# EAGLE schematic BitsTunnel (EAGLE 9.4.2)
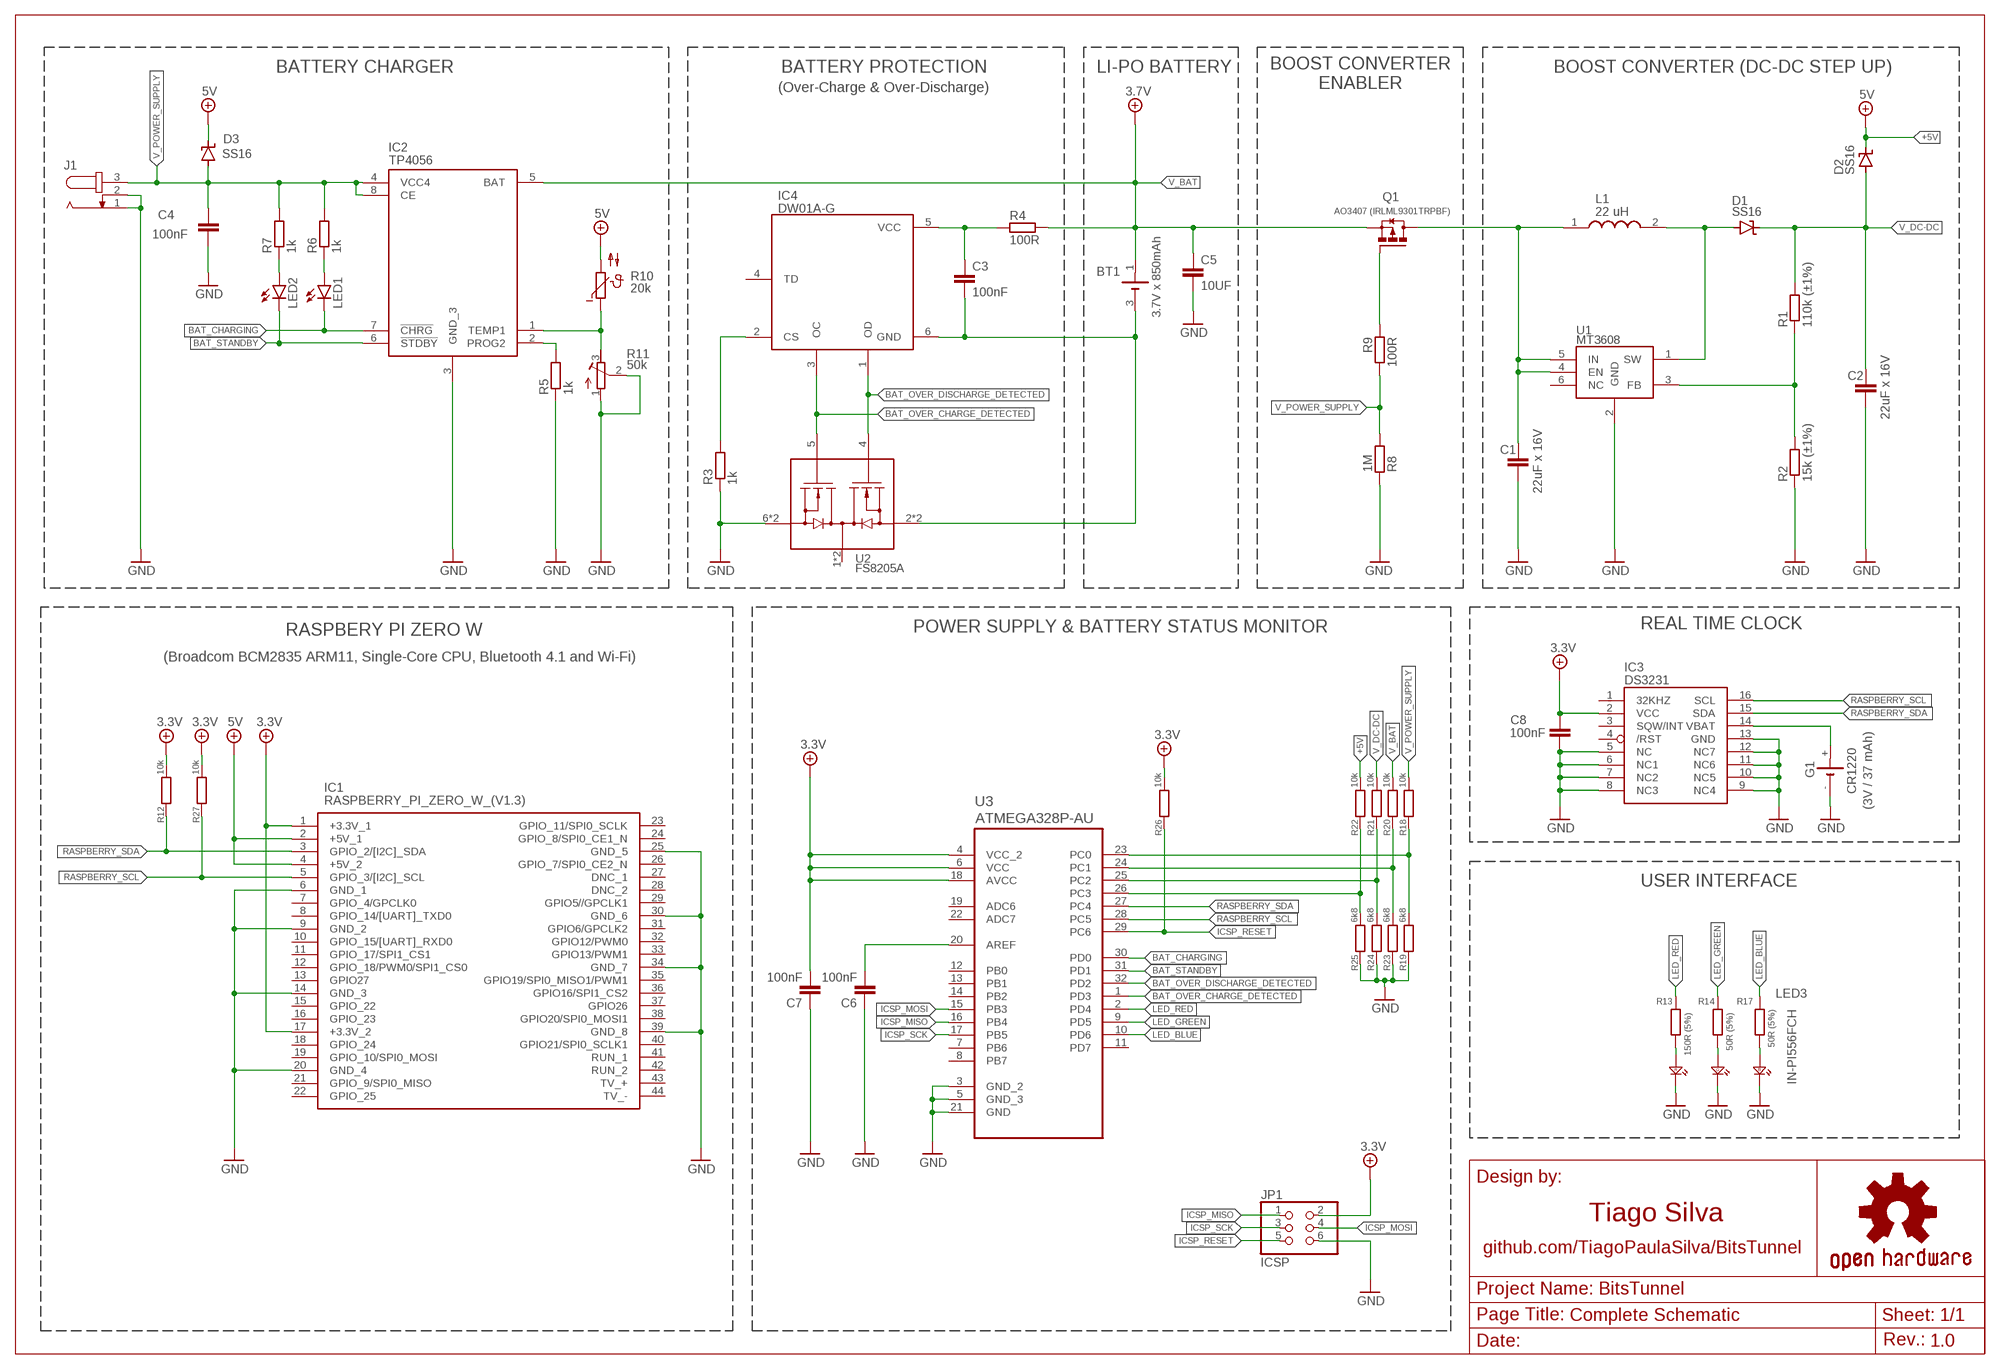
[diagram p0: schematic, sheet 1]

## Parts
BT1  3.7V x 850mAh  BATTERY-3PIN  [JST-3PIN]
C1  22uF x 16V  C-EUC0805  [C0805]
C2  22uF x 16V  C-EUC0805  [C0805]
C3  100nF  C-EUC0603  [C0603]
C4  100nF  C-EUC0603  [C0603]
C5  10UF  C-EUC0603  [C0603]
C6  100nF  C-EUC0805  [C0805]
C7  100nF  C-EUC0805  [C0805]
C8  100nF  C-EUC0805  [C0805]
D1  SS16  SUPPRESSOR-SMBJ  [SMBJ]
D2  SS16  SUPPRESSOR-SMBJ  [SMBJ]
D3  SS16  SUPPRESSOR-SMBJ  [SMBJ]
G1  CR1220  CH291-1220LF  [CH291-1220LF]
IC1  RASPBERRY_PI_ZERO_W_(V1.3)  [RASPBERRYPIZEROWV13]
IC2  TP4056  [SOIC127P600X175-9N]
IC3  DS3231/SO  [SO16W]
IC4  DW01A-G  [SOT95P190X145-6N]
J1  JACK-PLUG0  [SPC4077]
JP1  ICSP  PINHD-2X3  [2X03]
L1  22 uH  INDUCTOR  [INDUCTOR]
LED1  LEDCHIPLED_0805  [CHIPLED_0805]
LED2  LEDCHIPLED_0805  [CHIPLED_0805]
LED3  IN-PI556FCH  [INPI556FCH]
Q1  AO3407 (IRLML9301TRPBF)  IRLML6402TRPBF  [SOT23]
R1  110k (±1%)  R-EU_R0603  [R0603]
R2  15k (±1%)  R-EU_R0603  [R0603]
R3  1k  R-EU_R0603  [R0603]
R4  100R  R-EU_R0603  [R0603]
R5  1k  R-EU_R0603  [R0603]
R6  1k  R-EU_R0603  [R0603]
R7  1k  R-EU_R0603  [R0603]
R8  1M  R-EU_R0603  [R0603]
R9  100R  R-EU_R0603  [R0603]
R10  20k  NTC640  [P640]
R11  50k  R-TRIMM64P  [RTRIM64P]
R12  10k  R-EU_M0805  [M0805]
R13  150R (5%)  R-EU_R0603  [R0603]
R14  50R (5%)  R-EU_R0603  [R0603]
R17  50R (5%)  R-EU_R0603  [R0603]
R18  10k  R-EU_M0805  [M0805]
R19  6k8  R-EU_M0805  [M0805]
R20  10k  R-EU_M0805  [M0805]
R21  10k  R-EU_M0805  [M0805]
R22  10k  R-EU_M0805  [M0805]
R23  6k8  R-EU_M0805  [M0805]
R24  6k8  R-EU_M0805  [M0805]
R25  6k8  R-EU_M0805  [M0805]
R26  10k  R-EU_M0805  [M0805]
R27  10k  R-EU_M0805  [M0805]
U1  MT3608  [SOT95P280X145-6N]
U2  FS8205A  [SOP65P640X120-8N]
U3  ATMEGA328P-AU  [QFP80P900X900X120-32N]

## Nets
3.3V: C7.2 C8.2 IC1.1(+3.3V_1) IC1.17(+3.3V_2) IC3.2(VCC) JP1.2 R12.1 R26.1 R27.1 U3.4(VCC_2) U3.6(VCC) U3.18(AVCC)
+5V: D2.C D3.C IC1.2(+5V_1) IC1.4(+5V_2) R10.2 R22.1 ; supply symbol labelled 5V
BAT_CHARGING: IC2.7(!CHRG) LED1.C U3.30(PD0)
BAT_OVER_CHARGE_DETECTED: IC4.3(OC) U2.5(G2) U3.1(PD3)
BAT_OVER_DISCHARGE_DETECTED: IC4.1(OD) U2.4(G1) U3.32(PD2)
BAT_STANDBY: IC2.6(!STDBY) LED2.C U3.31(PD1)
GND [gnd]: C1.2 C2.2 C4.2 C5.2 C6.1 C7.1 C8.1 G1.- IC1.6(GND_1) IC1.9(GND_2) IC1.14(GND_3) IC1.20(GND_4) IC1.25(GND_5) IC1.30(GND_6) IC1.34(GND_7) IC1.39(GND_8) IC2.3(GND_3) IC3.5(NC) IC3.6(NC1) IC3.7(NC2) IC3.8(NC3) IC3.9(NC4) IC3.10(NC5) IC3.11(NC6) IC3.12(NC7) IC3.13(GND) J1.1 J1.2 JP1.6 LED3.4(KB4) LED3.5(KG6) LED3.6(KR5) R2.1 R3.1 R5.1 R8.2 R11.1(A) R11.2(S) R19.2 R23.2 R24.2 R25.2 U1.2(GND) U2.6(S2_1) U2.7(S2_1) U3.3(GND_2) U3.5(GND_3) U3.21(GND)
ICSP_MISO: JP1.1 U3.16(PB4)
ICSP_MOSI: JP1.4 U3.15(PB3)
ICSP_RESET: JP1.5 R26.2 U3.29(PC6)
ICSP_SCK: JP1.3 U3.17(PB5)
LED_BLUE: R17.1 U3.10(PD6)
LED_GREEN: R14.1 U3.9(PD5)
LED_RED: R13.1 U3.2(PD4)
N$1: R1.1 R2.2 U1.3(FB)
N$2: LED3.2(AR2) R13.2
N$3: D1.A L1.2 U1.1(SW)
N$6: IC2.2(PROG2) R5.2
N$7: IC4.2(CS) R3.2
N$8: C3.1 IC4.5(VCC) R4.2
N$9: G1.+ IC3.14(VBAT)
N$10: BT1.3(-) C3.2 IC4.6(GND) U2.2(S1_1) U2.3(S1_1)
N$11: LED1.A R6.1
N$13: C1.1 L1.1 Q1.3(D) U1.4(EN) U1.5(IN)
N$14: LED2.A R7.1
N$15: Q1.1(G) R9.2
N$16 [gnd]: IC2.1(TEMP1) R10.1 R11.3(E)
N$17: C6.2 U3.20(AREF)
N$18: R22.2 R25.1 U3.26(PC3)
N$19: R21.2 R24.1 U3.25(PC2)
N$20: R20.2 R23.1 U3.24(PC1)
N$21: LED3.1(AG1) R14.2
N$22: R18.2 R19.1 U3.23(PC0)
N$26: LED3.3(AB3) R17.2
RASPBERRY_SCL: IC1.5(GPIO_3/[I2C]_SCL) IC3.16(SCL) R27.2 U3.28(PC5)
RASPBERRY_SDA: IC1.3(GPIO_2/[I2C]_SDA) IC3.15(SDA) R12.2 U3.27(PC4)
V_BAT: BT1.1(+) C5.1 IC2.5(BAT) Q1.2(S) R4.1 R20.1 ; supply symbol labelled 3.7V
V_DC-DC: C2.1 D1.C D2.A R1.2 R21.1
V_POWER_SUPPLY: C4.1 D3.A IC2.4(VCC4) IC2.8(CE) J1.3 R6.2 R7.2 R8.1 R9.1 R18.1
Unconnected: IC1.7(GPIO_4/GPCLK0) IC1.8(GPIO_14/[UART]_TXD0) IC1.10(GPIO_15/[UART]_RXD0) IC1.11(GPIO_17/SPI1_CS1) IC1.12(GPIO_18/PWM0/SPI1_CS0) IC1.13(GPIO27) IC1.15(GPIO_22) IC1.16(GPIO_23) IC1.18(GPIO_24) IC1.19(GPIO_10/SPI0_MOSI) IC1.21(GPIO_9/SPI0_MISO) IC1.22(GPIO_25) IC1.23(GPIO_11/SPI0_SCLK) IC1.24(GPIO_8/SPI0_CE1_N) IC1.26(GPIO_7/SPI0_CE2_N) IC1.27(DNC_1) IC1.28(DNC_2) IC1.29(GPIO5//GPCLK1) IC1.31(GPIO6/GPCLK2) IC1.32(GPIO12/PWM0) IC1.33(GPIO13/PWM1) IC1.35(GPIO19/SPI0_MISO1/PWM1) IC1.36(GPIO16/SPI1_CS2) IC1.37(GPIO26) IC1.38(GPIO20/SPI0_MOSI1) IC1.40(GPIO21/SPI0_SCLK1) IC1.41(RUN_1) IC1.42(RUN_2) IC1.43(TV_+) IC1.44(TV_-) IC3.1(32KHZ) IC3.3(SQW/INT) IC3.4(/RST) IC4.4(TD) U1.6(NC) U2.1(D12_1) U2.8(D12_1) U3.7(PB6) U3.8(PB7) U3.11(PD7) U3.12(PB0) U3.13(PB1) U3.14(PB2) U3.19(ADC6) U3.22(ADC7)

## Notes on the sheet
- BATTERY CHARGER | BATTERY PROTECTION | LI-PO BATTERY
- BOOST CONVERTER
  ENABLER
- BOOST CONVERTER (DC-DC STEP UP)
- (Over-Charge & Over-Discharge)
- POWER SUPPLY & BATTERY STATUS MONITOR | REAL TIME CLOCK
- RASPBERY PI ZERO W
- (Broadcom BCM2835 ARM11, Single-Core CPU, Bluetooth 4.1 and Wi-Fi)
- (3V / 37 mAh)
- USER INTERFACE
- Tiago Silva
- github.com/TiagoPaulaSilva/BitsTunnel
- Complete Schematic
- 1.0

## Library data of the parts
BT1 = Battery-Cable:BATTERY-3PIN
C1-C8 = rcl:C-EU: CAPACITOR, European symbol; SPICEPREFIX: C
D1-D3 = diode:SUPPRESSOR-: Suppressor diode
G1 = battery:CH291-1220LF: Battery Holder, SMT, 12mm multicomp PART NO. CH291-1220LF Source: Data sheet <http://www.farnell.com/datasheets/1505860.pdf>
IC1 = Raspberry_Pi_Zero_W_(v1.3):RASPBERRY_PI_ZERO_W_(V1.3): Raspberry Pi Zero W (v1.3) Single-board Computers Source: Datasheet <https://cdn.sparkfun.com/assets/learn_tutorials/6/7/6/PiZero_1.pdf>; DESCRIPTION: Raspberry Pi Zero W (v1.3) Single-board Computers; HEIGHT: mm; MANUFACTURER_NAME: RASPBERRY-PI; MANUFACTURER_PART_NUMBER: Raspberry Pi Zero W (v1.3)
IC2 = TP4056:TP4056: 1A Standalone Linear Li-lon Battery Charger, SOP-8 Source: Datasheet <https://dlnmh9ip6v2uc.cloudfront.net/datasheets/Prototyping/TP4056.pdf>; DESCRIPTION: 1A Standalone Linear Li-lon Battery Charger, SOP-8; HEIGHT: 1.75mm; MANUFACTURER_NAME: NanJing Top Power; MANUFACTURER_PART_NUMBER: TP4056
IC3 = adafruit:DS3231
IC4 = DW01A-G:DW01A-G: one cell lithium-ion/polymer battery protection IC Source: Datasheet <http://www.ic-fortune.com/upload/Download/DW01x-DS-17_EN.pdf>; DESCRIPTION: one cell lithium-ion/polymer battery protection IC; HEIGHT: 1.45mm; MANUFACTURER_NAME: SII Semiconductor; MANUFACTURER_PART_NUMBER: DW01A-G
J1 = con-jack:JACK-PLUG: DC POWER JACK Power Jack, DC, Right Angle, Through Hole, Rated 5A at 16VDC, PC Terminals Distributor: Farnell (www.Farnell.de) Drawing: 84N1161.pdf / 84N1162.pdf Manufacturer: SPC Technology (www.spctechnology.com) Type: SPC4077 / SPC 4078; OC_FARNELL: unknown; OC_NEWARK: unknown
JP1 = pinhead:PINHD-2X3: PIN HEADER
L1 = Inductor:INDUCTOR
LED1 LED2 = led:LED: LED OSRAM: - CHIPLED LG R971, LG N971, LY N971, LG Q971, LY Q971, LO R971, LY R971 LH N974, LH R974 LS Q976, LO Q976, LY Q976 LO Q996 - Hyper CHIPLED LW Q18S LB Q993, LB Q99A, LB R99A - SideLED LS A670, LO A670, LY A670, LG A670, LP A670 LB A673, LV A673, LT A673, LW A673 LH A674 LY A675 LS A676, LA A676, LO A676, LY A676, LW A676 LS A679, LY A679, LG A679 - Hyper Micro SIDELED® LS Y876, LA Y876, LO Y876, LY Y876 LT Y87S - SmartLED LW L88C, LW L88S LB L89C, LB L89S, LG L890 LS L89K, LO L89K, LY L89K LS L896, LA L896, LO L896, LY L896 - TOPLED LS T670, LO T670, LY T670, LG T670, LP T670 LSG T670, LSP T670, LSY T670, LOP T670, LYG T670 LG T671, LOG T671, LSG T671 LB T673, LV T673, LT T673, LW T673 LH T674 LS T676, LA T676, LO T676, LY T676, LB T676, LH T676, LSB T676, LW T676 LB T67C, LV T67C, LT T67C, LS T67K, LO T67K, LY T67K, LW E67C LS E67B, LA E67B, LO E67B, LY E67B, LB E67C, LV E67C, LT E67C LW T67C LS T679, LY T679, LG T679 LS T770, LO T770, LY T770, LG T770, LP T770 LB T773, LV T773, LT T773, LW T773 LH T774 LS E675, LA E675, LY E675, LS T675 LS T776, LA T776, LO T776, LY T776, LB T776 LHGB T686 LT T68C, LB T68C - Hyper Mini TOPLED® LB M676 - Mini TOPLED Santana® LG M470 LS M47K, LO M47K, LY M47K Source: http://www.osram.convergy.de LUXEON: - LUMILED® LXK2-PW12-R00, LXK2-PW12-S00, LXK2-PW14-U00, LXK2-PW14-V00 LXK2-PM12-R00, LXK2-PM12-S00, LXK2-PM14-U00 LXK2-PE12-Q00, LXK2-PE12-R00, LXK2-PE12-S00, LXK2-PE14-T00, LXK2-PE14-U00 LXK2-PB12-K00, LXK2-PB12-L00, LXK2-PB12-M00, LXK2-PB14-N00, LXK2-PB14-P00, LXK2-PB14-Q00 LXK2-PR12-L00, LXK2-PR12-M00, LXK2-PR14-Q00, LXK2-PR14-R00 LXK2-PD12-Q00, LXK2-PD12-R00, LXK2-PD12-S00 LXK2-PH12-R00, LXK2-PH12-S00 LXK2-PL12-P00, LXK2-PL12-Q00, LXK2-PL12-R00 Source: www.luxeon.com KINGBRIGHT: KA-3528ASYC Source: www.kingbright.com
LED3 = LED RGB SMD:IN-PI556FCH: Standard LEDs - SMD RGB Digital LED Source: Datasheet <https://componentsearchengine.com/Datasheets/1/IN-PI556FCH.pdf>; DESCRIPTION: Standard LEDs - SMD RGB Digital LED; HEIGHT: 1.5mm; MANUFACTURER_NAME: Inolux; MANUFACTURER_PART_NUMBER: LED RGB 5050; MOUSER_PART_NUMBER: 743-IN-PI556FCH; MOUSER_PRICE-STOCK: https://www.mouser.com/Search/Refine.aspx?Keyword=743-IN-PI556FCH
Q1 = IRLML6402:IRLML6402: HEXFET P-Channel Power MOSFET; AVAILABILITY: Unavailable; MF: Infineon Technologies; MP: IRLML6402; PACKAGE: SC-59 Infineon Technologies; PRICE: None
R1-R9 R12-R14 R17-R27 = rcl:R-EU_: RESISTOR, European symbol; SPICEPREFIX: R
R10 = ptc-ntc:NTC640: PHILIPS NTC; OC_FARNELL: unknown; OC_NEWARK: unknown
R11 = resistor:R-TRIMM: Trimm resistor
U1 = MT3608:MT3608: High Efficiency 1.2MHz 2A Step Up Converter Source: Datasheet <https://www.olimex.com/Products/Breadboarding/BB-PWR-3608/resources/MT3608.pdf>; DESCRIPTION: High Efficiency 1.2MHz 2A Step Up Converter; HEIGHT: 1.45mm; MANUFACTURER_NAME: Aerosemi; MANUFACTURER_PART_NUMBER: MT3608
U2 = FS8205A:FS8205A: dual n-channel enhancement mode power MOFSET Source: Datasheet <http://www.ic-fortune.com/upload/Download/FS8205A-DS-12_EN.pdf>; DESCRIPTION: dual n-channel enhancement mode power MOFSET; HEIGHT: 1.2mm; MANUFACTURER_NAME: SII Semiconductor; MANUFACTURER_PART_NUMBER: FS8205A
U3 = Atmel_By_element14_Batch_1-00:ATMEGA328P-AU: 8-bit Microcontroller with In-System Programmable Flash; MPN: ATMEGA328P-AU; OC_FARNELL: 1715486; OC_NEWARK: 14R4631; PACKAGE: TQFP-32; SUPPLIER: Atmel

## Net classes
2 gnd: width 0.305 mm, drill 0.559 mm, clearance 0.254 mm